# EAGLE design Moty Light (EAGLE 7.2.0)
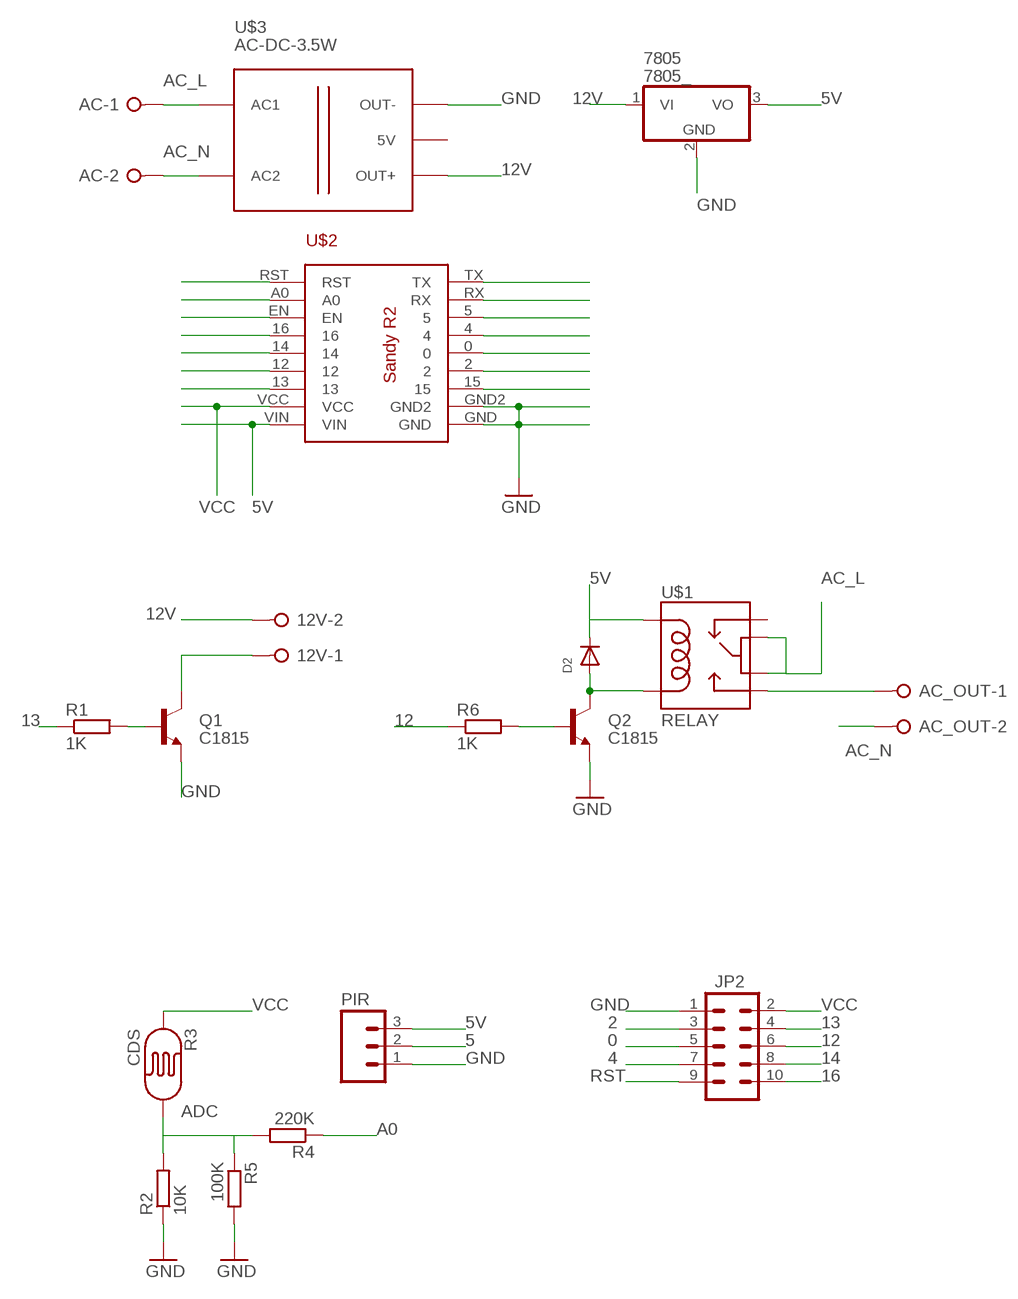
[diagram p0: schematic, sheet 1]

## Parts
12V  W237-02P  [W237-132]
7805  7805_  7805TV  [TO220V]
AC  W237-02P  [W237-132]
AC_OUT  W237-02P  [W237-132]
D2  DIODESMA  [SMADIODE]
JP2  M05X2PTH  [AVR_ICSP]
PIR  M03PTH  [1X03]
Q1  C1815  TRANSISTOR_NPNMMBT2222A  [SOT23-3]
Q2  C1815  TRANSISTOR_NPNMMBT2222A  [SOT23-3]
R1  1K  R-EU_R0805  [R0805]
R2  10K  R-EU_R0805  [R0805]
R3  CDS  PHOTOCELL  [PHOTOCELL_THIN]
R4  220K  R-EU_R0805  [R0805]
R5  100K  R-EU_R0805  [R0805]
R6  1K  R-EU_R0805  [R0805]
U$1  RELAY  MINIATURE_RELAY_JRC_21F  [MINIATURE_RELAY_JRC_21F]
U$2  MINI-ESP  [MINI-ESP]
U$3  AC-DC-3.5W  [AC-DC-3.5W]

## Nets
0: JP2.5 U$2.0
2: JP2.3 U$2.2
4: JP2.7 U$2.4
5: PIR.2 U$2.5
5V: 7805.3(VO) D2.C PIR.3 U$1.COIL1 U$2.VIN
12: JP2.6 R6.1 U$2.12
12V: 12V.2 7805.1(VI) U$3.J2.3(OUT+)
13: JP2.4 R1.1 U$2.13
14: JP2.8 U$2.14
16: JP2.10 U$2.16
A0: R4.1 U$2.A0
AC_L: AC.1 U$1.COM1 U$1.COM2 U$3.J1.1(AC1)
AC_N: AC.2 AC_OUT.2 U$3.J1.2(AC2)
ADC: R2.2 R3.2 R4.2 R5.1
D8: U$2.15
EN: U$2.EN
GND: 7805.2(GND) JP2.1 PIR.1 Q1.2(E) Q2.2(E) R2.1 R5.2 U$2.GND U$2.GND2 U$3.J2.1(OUT-)
N$1: 12V.1 Q1.3(C)
N$3: D2.A Q2.3(C) U$1.COIL2
N$4: Q2.1(B) R6.2
N$7: Q1.1(B) R1.2
N$8: AC_OUT.1 U$1.NO
RST: JP2.9 U$2.RST
RX: U$2.RX
TX: U$2.TX
VCC: JP2.2 R3.1 U$2.VCC
Unconnected: U$1.NC U$3.J2.2(5V)

## Library data of the parts
12V AC AC_OUT = con-wago-508:W237-02P: WAGO SREW CLAMP; OC_FARNELL: unknown; OC_NEWARK: unknown
7805 = linear:78*: Positive VOLTAGE REGULATOR Source: http://cache.national.com/ds/LM/LM78L05.pdf http://www.fairchildsemi.com/ds/LM/LM7805.pdf
D2 = adafruit:DIODE: Diode SMADIODE - SMA Surface Mount Package 20V 1A Schottky Diode Digikey: 641-1014-6-ND DO-1N4148 - Through Hole Small Current Diode SOD-123 20V 1 A (.5mV Vf) Schottky Diode - Digikey: MBRX120TPMSCT-ND SOD-323 10V 570mA (.38mV Vf, 3ns) Schottky Diode - Digikey: ZLLS410CT-ND SOD-523 30V 30mA Schottky Diode (RB751S-40TE61) - Digikey: RB751S-40TE61CT-ND SOT23-R/W - SOT23 Package (R = Solder Paste/Reflow Ovens, W = Hand-Soldering) BAT54Film 40V 300mA - Digikey: 497-7162-1-ND
JP2 = SparkFun-Connectors:M05X2: Header 5x2 Standard 10-pin dual row 0.1" header. Commonly used with AVR-ISP. Use with Spark Fun Electronics SKU: PRT-00778
PIR = SparkFun-Connectors:M03: Header 3 Standard 3-pin 0.1" header. Use with straight break away headers (SKU : PRT-00116), right angle break away headers (PRT-00553), swiss pins (PRT-00743), machine pins (PRT-00117), and female headers (PRT-00115). Molex polarized connector foot print use with SKU : PRT-08232 with associated crimp pins and housings.
Q1 Q2 = SparkFun-DiscreteSemi:TRANSISTOR_NPN: Generic NPN BJT MMBT2222A - TRANS-08049 (SOT-23, 1A 40V) MPSA42 - TRANS-09116 (SOT-23, 500mA 300V) MMBT5088LT1G - TRANS-11160 (SOT-23, 50 mA 30V) BC547 - COM-08928 <http://www.sparkfun.com/products/8928> (TO-92 45V 100mA) (1.Collector 2.Base 3.Emitter) 2N3904 - COM-00521 <http://www.sparkfun.com/products/521> (TO-92 40V 200mA) (1.Emitter 2.Base 3.Collector) P2N2222A - COM-12852 <http://www.sparkfun.com/products/12852> (TO-92 40V 600mA) (1.Collector 2.Base 3.Emitter); PROD_ID: TRANS-08049; VALUE: MMBT2222A
R1 R2 R4-R6 = rcl:R-EU_: RESISTOR, European symbol
R3 = SparkFun-Sensors:PHOTOCELL: CdS photoresistor. This is a low cost way to detect light levels. Resistance decreases with more incoming light. SparkFun SKU: SEN-09088
U$1 = My Eagle Lib:MINIATURE_RELAY_JRC_21F
U$2 = My Eagle Lib:MINI-ESP
U$3 = diy-modules:AC-DC-3.5W: AC/DC 3.5W Converter

## Board
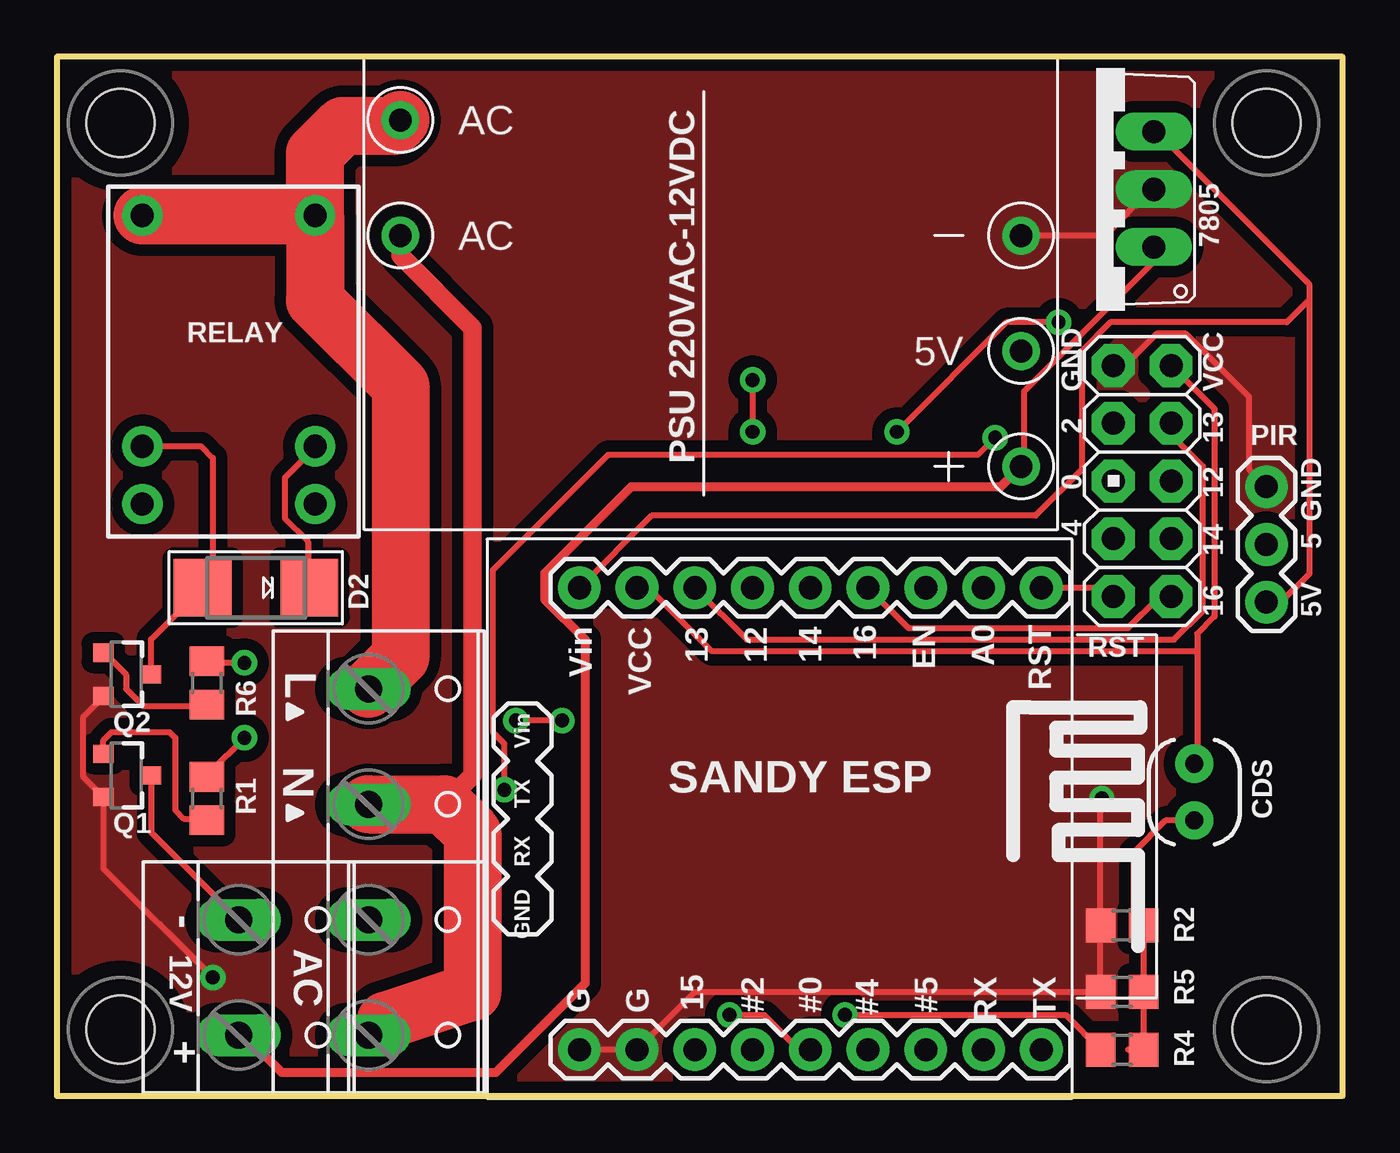
[diagram p1: board, top side]
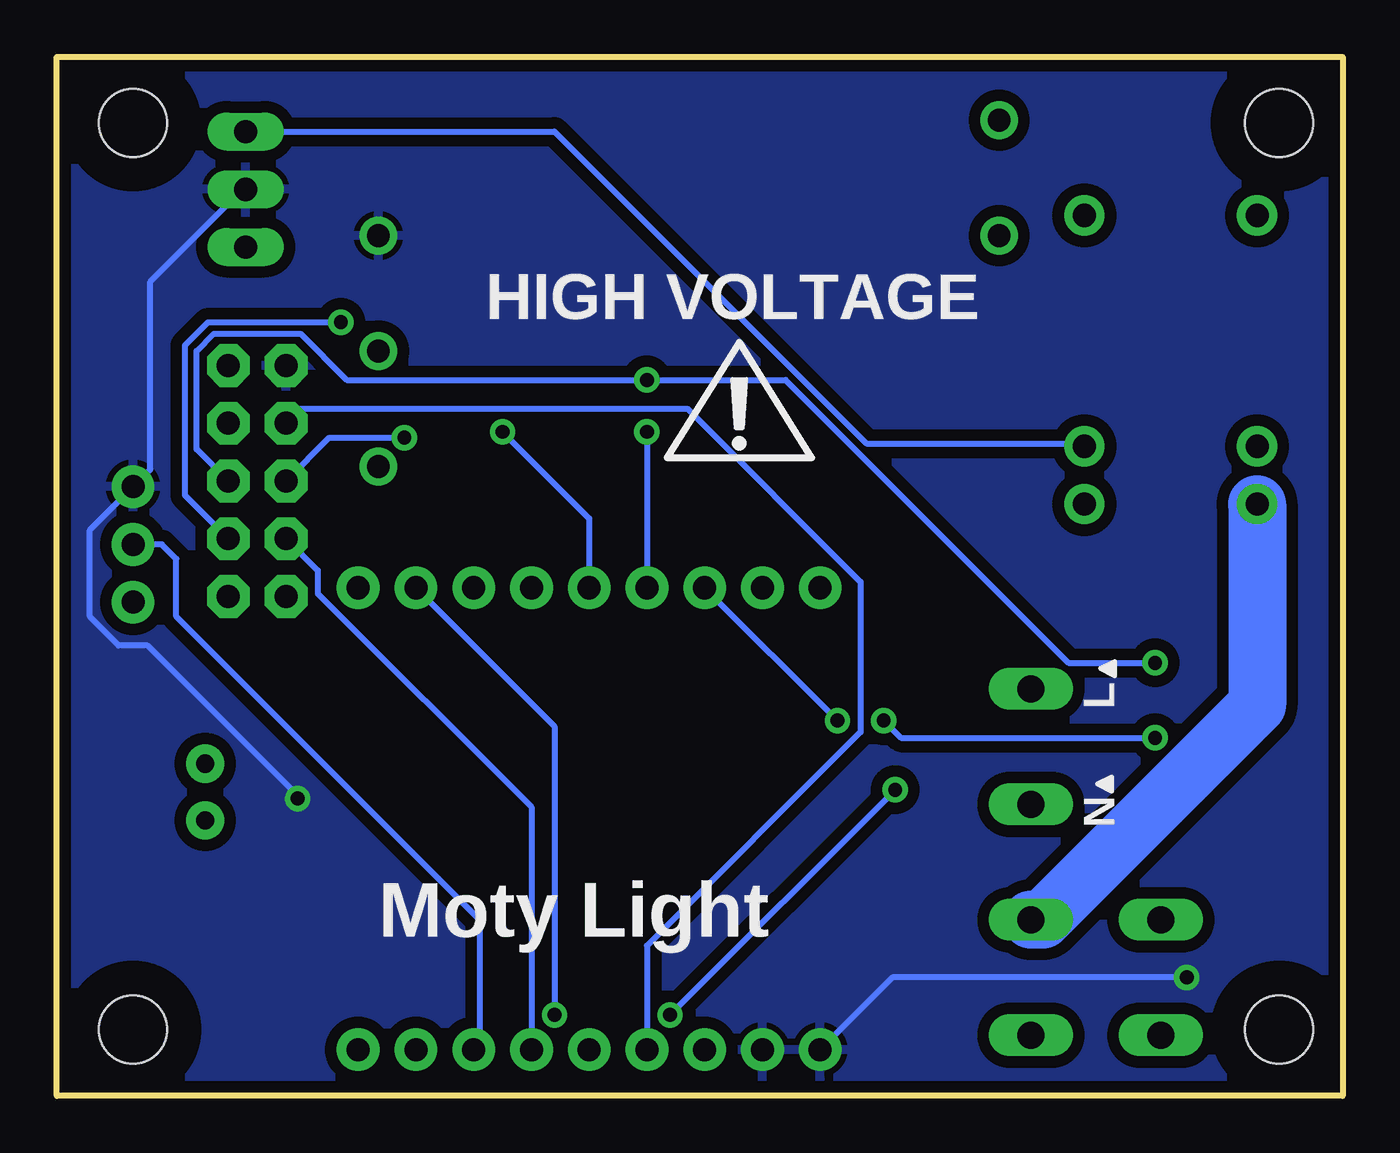
[diagram p2: board, bottom side, seen from below]

Size 56.57 x 45.71 mm. Coordinates in mm from the lower left corner, seen from the top.
Outline: 0,0 56.57,0 56.57,45.71 0,45.71 0,0
Copper layers (1*16): Top 0.035mm / dielectric 1.5mm / Bottom 0.035mm
Design rules "default *": minimum track width 10mil, minimum drill 24mil, track to track 10mil, track to pad 10mil, pad to pad 10mil, via to via 10mil, smd to smd 8mil, copper to edge 20mil, drill to drill 12mil, minimum pad ring 13mil, minimum via ring 10mil, stop-mask expansion 4mil, vias tented up to drill 0mil, thermal gap 10mil

### Footprints (pad centres in the part's own frame; a part is rotated, then mirrored left to right if it is on the bottom)
W237-132 = drill 1.194 long: 1 -2.54,-0.635; 2 2.54,-0.635
TO220V = drill 1.016 long: 1 -2.54,-2.54; 2 0,-2.54; 3 2.54,-2.54
SMADIODE = smd 2.54 x 2.54: A 2.349,0; C -2.349,0
AVR_ICSP = drill 1.016 pad 1.88 octagon: 1 -1.27,5.08; 2 1.27,5.08; 3 -1.27,2.54; 4 1.27,2.54; 5 -1.27,0; 6 1.27,0; 7 -1.27,-2.54; 8 1.27,-2.54; 9 -1.27,-5.08; 10 1.27,-5.08
1X03 = drill 1.016 pad 1.88: 1 0,0; 2 2.54,0; 3 5.08,0
SOT23-3 = smd 0.8 x 0.9: 1 -0.95,-1; 2 0.95,-1; 3 0,1.1
R0805 = smd 1.3 x 1.5: 1 -0.95,0; 2 0.95,0
PHOTOCELL_THIN = drill 0.8 pad 1.676: 1 -1.15,0; 2 1.35,0
MINIATURE_RELAY_JRC_21F = drill 1.016 pad 1.778: COIL1 3.81,2.6; COIL2 3.81,-5; COM1 -6.35,2.6; COM2 -6.35,-5; NC 6.35,2.6; NO 6.35,-5
MINI-ESP = drill 1.016 pad 1.88: 0 10.16,1.524; 2 10.16,-1.016; 4 10.16,4.064; 5 10.16,6.604; 12 -10.16,-1.016; 13 -10.16,-3.556; 14 -10.16,1.524; 15 10.16,-3.556; 16 -10.16,4.064; A0 -10.16,9.144; EN -10.16,6.604; GND 10.16,-8.636; GND2 10.16,-6.096; RST -10.16,11.684; RX 10.16,9.144; TX 10.16,11.684; VCC -10.16,-6.096; VIN -10.16,-8.636
AC-DC-3.5W = drill 1: J1.1 -13.335,7.62; J1.2 -13.335,2.54; J2.1 13.97,2.54; J2.2 13.97,-2.54; J2.3 13.97,-7.62
KFH-M3 = hole 3: 0,0

### Placement (x,y rotation side)
12V  8.64,5.21 270 top
7805  45.72,39.88 90 top
AC  14.35,15.37 270 top
AC_OUT  14.35,5.21 270 top
D2  8.76,22.35 180 top
JP2  47.75,27.05 0 top
PIR  53.21,26.8 270 top
Q1  3.05,14.1 270 top
Q2  3.05,18.54 270 top
R1  6.6,13.08 270 top
R2  46.86,7.49 0 top
R3  50.04,13.46 270 top
R4  46.86,2.03 0 top
R5  46.86,4.57 180 top
R6  6.6,18.16 270 top
U$1  8.76,32.38 270 top
U$2  31.62,12.19 270 top
U$3  28.45,35.31 0 top
U$4  [ICON_PIN1_B]  10.79,13.72 0 bottom
U$5  [ICON_PIN1_B]  10.79,16.89 180 top
U$6  [KFH-M3]  2.79,2.92 0 top
U$7  [KFH-M3]  53.21,2.92 0 top
U$8  [KFH-M3]  53.21,42.8 0 top
U$9  [KFH-M3]  2.79,42.8 0 top
U$11  [ICON_PIN1_B]  10.67,18.8 0 bottom
U$12  [ICON_PIN1_B]  10.79,12.45 180 top
U$17  [ICON_EXL-S]  26.54,29.97 0 bottom

### Tracks (layer width: path | path; a pad name or v marks a point on that pad's centre or on a via)
0  (via drill 0.61)
  Top 0.254: U$2.0 32.64,2.03 31.11,3.56 v29.59,3.56 | v19.68,13.46 19.68,15.49 19.18,16 19.18,23.11 24.26,28.19 40.51,28.19 v41.28,28.96
  Bottom 0.254: v19.68,13.46 v29.59,3.56 | v41.28,28.96 44.58,28.96 JP2.5
2
  Bottom 0.254: U$2.2 30.61,6.6 21.21,16 21.21,22.61 28.83,30.23 45.85,30.23 JP2.3
4
  Bottom 0.254: U$2.4 35.69,12.7 45.09,22.1 45.09,23.11 JP2.7
5
  Bottom 0.254: PIR.2 51.94,24.26 51.31,23.62 51.31,21.08 37.97,7.75 37.97,2.29 U$2.5
5V
  Top 0.254: D2.C 11.05,22.35 11.05,24.38 10.03,25.4 10.03,27.18 11.3,28.45 U$1.COIL1 | 7805.3 48.39,42.42 55.12,35.69 55.12,35.05 | U$2.VIN 26.16,25.53 43.05,25.53 45.09,27.56 45.09,32.77 46.36,34.04 54.1,34.04 55.12,35.05 | PIR.3 53.85,21.72 55.12,22.99 55.12,35.05
  Bottom 0.254: 7805.3 34.67,42.42 20.96,28.7 11.56,28.7 U$1.COIL1
12  (via drill 0.61)
  Top 0.254: v8.26,19.05 6.73,19.05 R6.1 | v30.61,31.5 v30.61,29.21
  Bottom 0.254: v8.26,19.05 12.07,19.05 24.51,31.5 v30.61,31.5 43.82,31.5 45.85,33.53 49.66,33.53 50.42,32.77 50.42,28.45 JP2.6 | v30.61,29.21 U$2.12
12V
  Top 0.254: U$3.J2.3 42.55,27.69 42.55,30.99 48.13,36.58 48.13,37.34 7805.1 | 8,2.54 12V.2
  Top 0.406: U$3.J2.3 41.53,26.8 25.27,26.8 21.46,22.99 21.46,21.84 23.24,20.07 23.24,4.95 19.3,1.02 9.91,1.02 8.26,2.67 12V.2
13  (via drill 0.61)
  Top 0.254: v8.26,15.75 6.73,14.22 R1.1 | v22.23,16.51 v20.19,16.51 | U$2.13 30.35,20.07 49.15,20.07 50.42,21.34 50.42,27.69 49.15,28.96 49.15,29.46 JP2.4
  Bottom 0.254: v8.26,15.75 19.43,15.75 v20.19,16.51 | U$2.13 v22.23,16.51
14  (via drill 0.61)
  Top 0.254: v36.96,29.21 41.78,34.04 v44.07,34.04
  Bottom 0.254: U$2.14 33.15,25.4 v36.96,29.21 | v44.07,34.04 49.91,34.04 50.93,33.02 50.93,26.42 JP2.8
16
  Top 0.254: U$2.16 37.47,20.57 47.12,20.57 48.39,21.84 48.9,21.84 JP2.10
A0  (via drill 0.61)
  Top 0.254: v34.67,3.56 44.39,3.56 R4.1
  Bottom 0.254: v34.67,3.56 34.67,16.26 U$2.A0
AC_L
  Top 2.54: U$1.COM1 11.36,41.46 12.57,42.67 14.86,42.67 U$3.J1.1 | U$1.COM2 U$1.COM1 | U$1.COM1 11.36,34.99 15.11,31.24 15.11,19.3 AC.1
AC_N
  Top 0.254: AC_OUT.2 13.84,2.79 14.48,3.3
  Top 0.813: U$3.J1.2 15.11,36.96 18.29,33.78 18.29,14.1 17.02,12.83
  Top 2.54: AC.2 17.02,12.83 18.29,11.56 18.29,4.57 14.48,3.3
ADC
  Top 0.254: 47.12,2.03 R4.2 R5.1 R2.2 47.37,7.62 47.37,10.72 48.77,12.11 R3.2
GND  (via drill 0.61)
  Top 0.254: U$3.J2.1 46.1,37.85 48.13,39.88 7805.2 | JP2.1 46.61,32.26 47.12,32.26 48.39,33.53 49.66,33.53 52.45,30.73 52.45,27.56 PIR.1 | U$2.GND U$2.GND2 28.07,4.57 R5.2 R2.1 45.91,13.02 v45.97,13.08 | Q2.2 2.05,17.54 1.14,16.64 1.14,14.05 Q1.2 2.05,10.02 v6.86,5.21
  Bottom 0.254: 7805.2 48.39,39.88 52.45,35.81 52.45,27.56 PIR.1 55.12,24.89 55.12,21.08 53.85,19.81 52.58,19.81 45.97,13.21 v45.97,13.08 | v6.86,5.21 19.81,5.21 U$2.GND
  pour Bottom (isolate 0.508): -5.84,47.5 67.69,47.63 67.69,-3.81 -5.84,-3.94
  pour Top (isolate 0.508, no thermals): -5.84,47.5 67.69,47.63 67.69,-3.81 -5.84,-3.94
N$1
  Top 0.254: Q1.3 4.15,11.6 12V.1
N$3
  Top 0.254: Q2.3 4.15,20.09 D2.A 6.86,22.8 6.86,28.07 6.35,28.58 U$1.COIL2
N$4
  Top 0.254: Q2.1 2.1,19.49 3.05,18.54 3.05,17.91 3.81,17.15 6.54,17.15 R6.2
N$7
  Top 0.254: Q1.1 2.05,15.64 2.41,16 4.95,16 5.21,15.75 5.21,12.57 5.59,12.19 6.54,12.19 R1.2
N$8
  Bottom 2.54: U$1.NO 3.76,17.19 13.21,7.75 AC_OUT.1
RST
  Top 0.254: U$2.RST 46.1,22.35 JP2.9
VCC
  Top 0.254: 50.17,19.56 50.17,20.32 50.93,21.08 50.93,30.23 JP2.2 | 50.17,19.56 50.17,14.74 R3.1 | U$2.VCC 26.04,22.35 28.83,19.56 50.17,19.56

### Text on the board
tNames: GND | VCC | 2 | 13 | GND | PSU 220VAC-12VDC | 0 | 12 | 4 | 5 | 14 | 5V | 16 | RST | L | N | CDS | - | 12V | AC | +
bNames: HIGH VOLTAGE | L | N | Moty Light